# Altium schematic sheet FPGA_7A35T_GTP.SchDoc: RFSoC AMC
size 420 x 297 mm; CompanyName: WUT; DrawnBy: T. Przywozki; Organization: WUT ISE; Address1: Warsaw University of Technology; Address2: Nowowiejska 15/19 00-665 Warsaw; Address3: Tomasz.Przywozki@pw.edu.pl; DocumentNumber: 16; Revision: 1; SheetNumber: 16; SheetTotal: 45; Project: RFSoC AMC; ModifiedBy: T. Przywozki; CreateDate: -; CheckedDate: -; DivGrp: ISE; Designer: T. Przywozki; ModifiedDate: -; ProjectName: ADC/DAC MEZZANINE
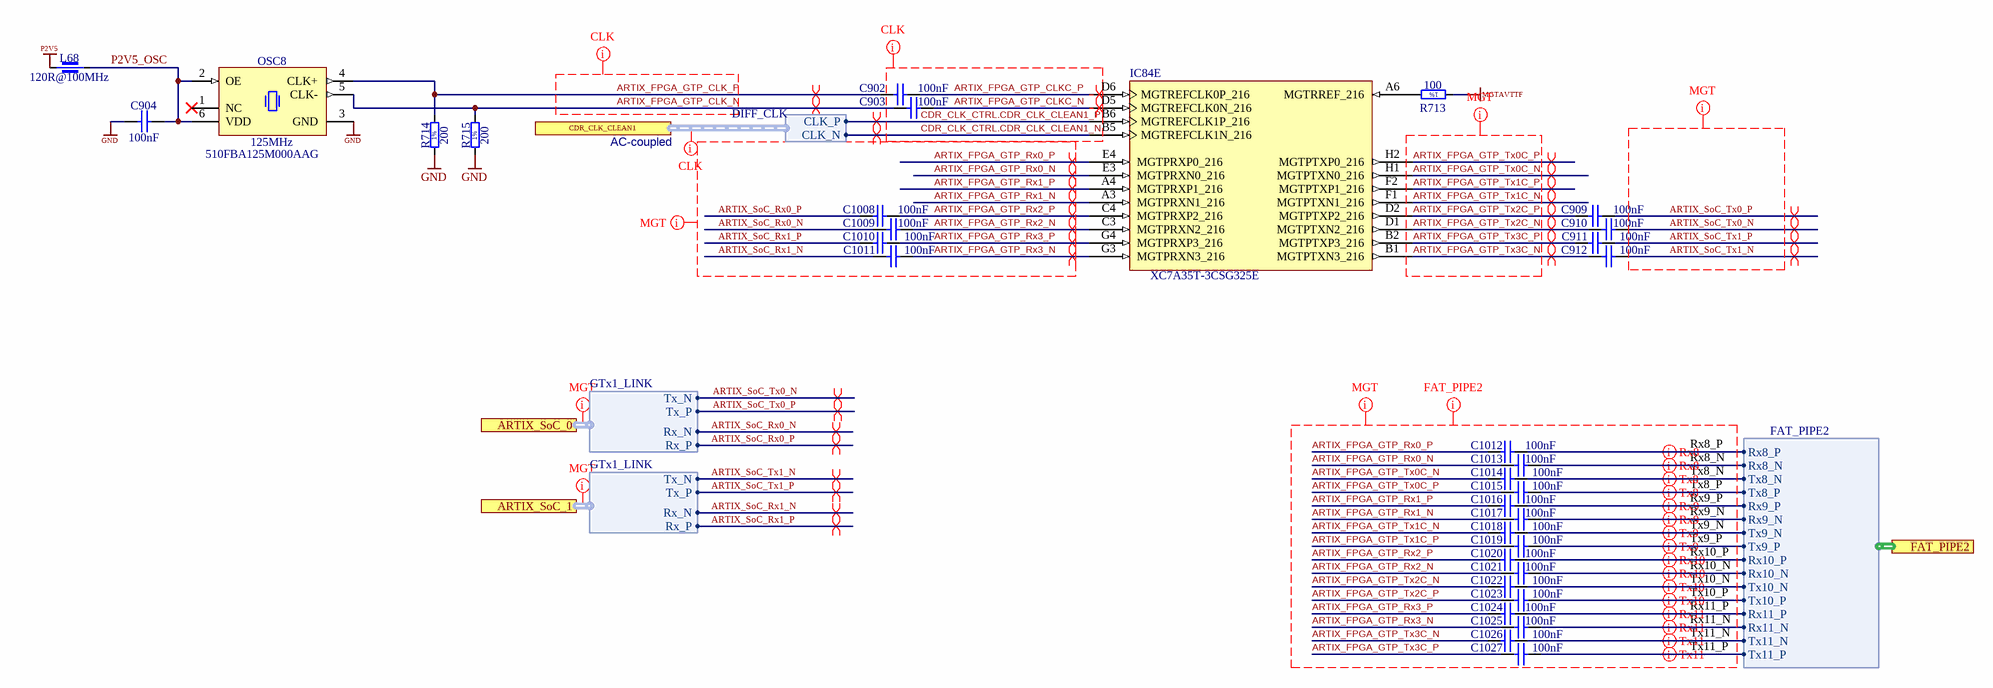
[diagram p0: FPGA_7A35T_GTP.SchDoc]

## Parts
C902  100nF  [CAPC0603X33N]
C903  100nF  [CAPC0603X33N]
C904  100nF  [CAPC0603X33N]
C909  100nF  [CAPC0603X33N]
C910  100nF  [CAPC0603X33N]
C911  100nF  [CAPC0603X33N]
C912  100nF  [CAPC0603X33N]
C1008  100nF  [CAPC0603X33N]
C1009  100nF  [CAPC0603X33N]
C1010  100nF  [CAPC0603X33N]
C1011  100nF  [CAPC0603X33N]
C1012  100nF  [CAPC0603X33N]
C1013  100nF  [CAPC0603X33N]
C1014  100nF  [CAPC0603X33N]
C1015  100nF  [CAPC0603X33N]
C1016  100nF  [CAPC0603X33N]
C1017  100nF  [CAPC0603X33N]
C1018  100nF  [CAPC0603X33N]
C1019  100nF  [CAPC0603X33N]
C1020  100nF  [CAPC0603X33N]
C1021  100nF  [CAPC0603X33N]
C1022  100nF  [CAPC0603X33N]
C1023  100nF  [CAPC0603X33N]
C1024  100nF  [CAPC0603X33N]
C1025  100nF  [CAPC0603X33N]
C1026  100nF  [CAPC0603X33N]
C1027  100nF  [CAPC0603X33N]
IC84  XC7A35T-3CSG325E  [CSG325]  (part E of 9)
L68  120R@100MHz  [INDC1005X55N]
OSC8  125MHz  Manufacturer Part Number: 510FBA125M000AAG  [OSC_SILICON-LAB_SI510-6N(5X7)]
R713  100  [RESC1005X40N]
R714  200  [RESC1005X40N]
R715  200  [RESC1005X40N]

## Ports
ARTIX_SoC_0 (harness GTx1_LINK), ARTIX_SoC_1 (harness GTx1_LINK), CDR_CLK_CLEAN1 (harness DIFF_CLK), FAT_PIPE2 (harness FAT_PIPE2)

## Harnesses
GTx1_LINK: Rx_P, Rx_N, Tx_P, Tx_N
DIFF_CLK: CLK_P, CLK_N
FAT_PIPE2: Rx8_P, Rx8_N, Tx8_N, Tx8_P, Rx9_P, Rx9_N, Tx9_N, Tx9_P, Rx10_P, Rx10_N, Tx10_N, Tx10_P, Rx11_P, Rx11_N, Tx11_N, Tx11_P

## Nets
GND: C904.1 OSC8.3(GND) R714.1 R715.1
MGTAVTTF: R713.1
P2V5: L68.2
ARTIX_FPGA_GTP_CLK_N: C903.1 OSC8.5(CLK-) R715.2
ARTIX_FPGA_GTP_CLK_P: C902.1 OSC8.4(CLK+) R714.2
ARTIX_FPGA_GTP_CLKC_N: C903.2 IC84.D5(MGTREFCLK0N_216)
ARTIX_FPGA_GTP_CLKC_P: C902.2 IC84.D6(MGTREFCLK0P_216)
ARTIX_FPGA_GTP_Rx0_N: C1013.2 IC84.E3(MGTPRXN0_216)
ARTIX_FPGA_GTP_Rx0_P: C1012.2 IC84.E4(MGTPRXP0_216)
ARTIX_FPGA_GTP_Rx1_N: C1017.2 IC84.A3(MGTPRXN1_216)
ARTIX_FPGA_GTP_Rx1_P: C1016.2 IC84.A4(MGTPRXP1_216)
ARTIX_FPGA_GTP_Rx2_N: C1009.1 C1021.2 IC84.C3(MGTPRXN2_216)
ARTIX_FPGA_GTP_Rx2_P: C1008.1 C1020.2 IC84.C4(MGTPRXP2_216)
ARTIX_FPGA_GTP_Rx3_N: C1011.1 C1025.2 IC84.G3(MGTPRXN3_216)
ARTIX_FPGA_GTP_Rx3_P: C1010.1 C1024.2 IC84.G4(MGTPRXP3_216)
ARTIX_FPGA_GTP_Tx0C_N: C1014.2 IC84.H1(MGTPTXN0_216)
ARTIX_FPGA_GTP_Tx0C_P: C1015.2 IC84.H2(MGTPTXP0_216)
ARTIX_FPGA_GTP_Tx1C_N: C1018.2 IC84.F1(MGTPTXN1_216)
ARTIX_FPGA_GTP_Tx1C_P: C1019.2 IC84.F2(MGTPTXP1_216)
ARTIX_FPGA_GTP_Tx2C_N: C910.2 C1022.2 IC84.D1(MGTPTXN2_216)
ARTIX_FPGA_GTP_Tx2C_P: C909.2 C1023.2 IC84.D2(MGTPTXP2_216)
ARTIX_FPGA_GTP_Tx3C_N: C912.2 C1026.2 IC84.B1(MGTPTXN3_216)
ARTIX_FPGA_GTP_Tx3C_P: C911.2 C1027.2 IC84.B2(MGTPTXP3_216)
ARTIX_SoC_Rx0_N: C1009.2 ; port ARTIX_SoC_0.Rx_N
ARTIX_SoC_Rx0_P: C1008.2 ; port ARTIX_SoC_0.Rx_P
ARTIX_SoC_Rx1_N: C1011.2 ; port ARTIX_SoC_1.Rx_N
ARTIX_SoC_Rx1_P: C1010.2 ; port ARTIX_SoC_1.Rx_P
ARTIX_SoC_Tx0_N: C910.1 ; port ARTIX_SoC_0.Tx_N
ARTIX_SoC_Tx0_P: C909.1 ; port ARTIX_SoC_0.Tx_P
ARTIX_SoC_Tx1_N: C912.1 ; port ARTIX_SoC_1.Tx_N
ARTIX_SoC_Tx1_P: C911.1 ; port ARTIX_SoC_1.Tx_P
CDR_CLK_CTRL.CDR_CLK_CLEAN1_N: IC84.B5(MGTREFCLK1N_216) ; port CDR_CLK_CLEAN1.CLK_N
CDR_CLK_CTRL.CDR_CLK_CLEAN1_P: IC84.B6(MGTREFCLK1P_216) ; port CDR_CLK_CLEAN1.CLK_P
P2V5_OSC: C904.2 L68.1 OSC8.2(OE) OSC8.6(VDD)
Rx8_N: C1013.1 ; port FAT_PIPE2.Rx8_N
Rx8_P: C1012.1 ; port FAT_PIPE2.Rx8_P
Rx9_N: C1017.1 ; port FAT_PIPE2.Rx9_N
Rx9_P: C1016.1 ; port FAT_PIPE2.Rx9_P
Rx10_N: C1021.1 ; port FAT_PIPE2.Rx10_N
Rx10_P: C1020.1 ; port FAT_PIPE2.Rx10_P
Rx11_N: C1025.1 ; port FAT_PIPE2.Rx11_N
Rx11_P: C1024.1 ; port FAT_PIPE2.Rx11_P
Tx8_N: C1014.1 ; port FAT_PIPE2.Tx8_N
Tx8_P: C1015.1 ; port FAT_PIPE2.Tx8_P
Tx9_N: C1018.1 ; port FAT_PIPE2.Tx9_N
Tx9_P: C1019.1 ; port FAT_PIPE2.Tx9_P
Tx10_N: C1022.1 ; port FAT_PIPE2.Tx10_N
Tx10_P: C1023.1 ; port FAT_PIPE2.Tx10_P
Tx11_N: C1026.1 ; port FAT_PIPE2.Tx11_N
Tx11_P: C1027.1 ; port FAT_PIPE2.Tx11_P
NetIC84_A6: IC84.A6(MGTRREF_216) R713.2

Not connected (* = marked no-connect by the designer): OSC8 1(NC)*

## Layout directives
net class CLK: (no net found under the mark), ARTIX_FPGA_GTP_CLK_N, ARTIX_FPGA_GTP_CLK_P, ARTIX_FPGA_GTP_CLKC_N, ARTIX_FPGA_GTP_CLKC_P, CDR_CLK_CTRL.CDR_CLK_CLEAN1_N, CDR_CLK_CTRL.CDR_CLK_CLEAN1_P
net class MGT: (no net found under the mark)
net class MGT; net class GT: ARTIX_FPGA_GTP_Rx0_N, ARTIX_FPGA_GTP_Rx0_P, ARTIX_FPGA_GTP_Rx1_N, ARTIX_FPGA_GTP_Rx1_P, ARTIX_FPGA_GTP_Rx2_N, ARTIX_FPGA_GTP_Rx2_P, ARTIX_FPGA_GTP_Rx3_N, ARTIX_FPGA_GTP_Rx3_P, ARTIX_FPGA_GTP_Tx0C_N, ARTIX_FPGA_GTP_Tx0C_P, ARTIX_FPGA_GTP_Tx1C_N, ARTIX_FPGA_GTP_Tx1C_P, ARTIX_FPGA_GTP_Tx2C_N, ARTIX_FPGA_GTP_Tx2C_P, ARTIX_FPGA_GTP_Tx3C_N, ARTIX_FPGA_GTP_Tx3C_P, ARTIX_SoC_Rx0_N, ARTIX_SoC_Rx0_P, ARTIX_SoC_Rx1_N, ARTIX_SoC_Rx1_P, ARTIX_SoC_Tx0_N, ARTIX_SoC_Tx0_P, ARTIX_SoC_Tx1_N, ARTIX_SoC_Tx1_P, Rx8_N, Rx8_P, Rx9_N, Rx9_P, Rx10_N, Rx10_P, Rx11_N, Rx11_P, Tx8_N, Tx8_P, Tx9_N, Tx9_P, Tx10_N, Tx10_P, Tx11_N, Tx11_P
differential pair: ARTIX_FPGA_GTP_CLK_N, ARTIX_FPGA_GTP_CLK_P, ARTIX_FPGA_GTP_CLKC_N, ARTIX_FPGA_GTP_CLKC_P, ARTIX_FPGA_GTP_Rx0_N, ARTIX_FPGA_GTP_Rx0_P, ARTIX_FPGA_GTP_Rx1_N, ARTIX_FPGA_GTP_Rx1_P, ARTIX_FPGA_GTP_Rx2_N, ARTIX_FPGA_GTP_Rx2_P, ARTIX_FPGA_GTP_Rx3_N, ARTIX_FPGA_GTP_Rx3_P, ARTIX_FPGA_GTP_Tx0C_N, ARTIX_FPGA_GTP_Tx0C_P, ARTIX_FPGA_GTP_Tx1C_N, ARTIX_FPGA_GTP_Tx1C_P, ARTIX_FPGA_GTP_Tx2C_N, ARTIX_FPGA_GTP_Tx2C_P, ARTIX_FPGA_GTP_Tx3C_N, ARTIX_FPGA_GTP_Tx3C_P, ARTIX_SoC_Rx0_N, ARTIX_SoC_Rx0_P, ARTIX_SoC_Rx1_N, ARTIX_SoC_Rx1_P, ARTIX_SoC_Tx0_N, ARTIX_SoC_Tx0_P, ARTIX_SoC_Tx1_N, ARTIX_SoC_Tx1_P, CDR_CLK_CTRL.CDR_CLK_CLEAN1_N, CDR_CLK_CTRL.CDR_CLK_CLEAN1_P, Rx8_N, Rx8_P, Rx9_N, Rx9_P, Rx10_N, Rx10_P, Rx11_N, Rx11_P, Tx8_N, Tx8_P, Tx9_N, Tx9_P, Tx10_N, Tx10_P, Tx11_N, Tx11_P
net class FAT_PIPE2: ARTIX_FPGA_GTP_Rx0_N, ARTIX_FPGA_GTP_Rx0_P, ARTIX_FPGA_GTP_Rx1_N, ARTIX_FPGA_GTP_Rx1_P, ARTIX_FPGA_GTP_Rx2_N, ARTIX_FPGA_GTP_Rx2_P, ARTIX_FPGA_GTP_Rx3_N, ARTIX_FPGA_GTP_Rx3_P, ARTIX_FPGA_GTP_Tx0C_N, ARTIX_FPGA_GTP_Tx0C_P, ARTIX_FPGA_GTP_Tx1C_N, ARTIX_FPGA_GTP_Tx1C_P, ARTIX_FPGA_GTP_Tx2C_N, ARTIX_FPGA_GTP_Tx2C_P, ARTIX_FPGA_GTP_Tx3C_N, ARTIX_FPGA_GTP_Tx3C_P, Rx8_N, Rx8_P, Rx9_N, Rx9_P, Rx10_N, Rx10_P, Rx11_N, Rx11_P, Tx8_N, Tx8_P, Tx9_N, Tx9_P, Tx10_N, Tx10_P, Tx11_N, Tx11_P

## Notes on the sheet
- AC-coupled
- Project/Equipment
- Document
- Designer
- Drawn by
- Check.by
- Copyright WUT ISE 2021
  This documentation describes Open Hardware and is licensed under CERN OHL v.1.1. You may redistribute and modify this documentaction under the terms of the CERN OHL v1.1.
  (http://ohwr.org/CERNOHL). This documentation is dristributed WITHOUT ANY EXPRESS OR IMPLIED WARRANTY, INCLUDING OF MERCHANTABLITY, SATISFACTORY QUALITY AND FITNESS FOR A PARTICULAR PURPOSE. Please see the CERN OHL v.1.1 for applicable conditions
- File
- Last Mod.
- Print Date
- Sheet
- Size
- A3
- of
- Rev
- Contact:
- (in symbol R0402_100R_1%_0.0625W_100PPM) 1%
- (in symbol R0402_200R_1%_0.0625W_100PPM) 1%

## Library data of the parts
C902-C904 C909-C912 C1008-C1027 = CC0201_100NF_6.3V_10%_X5R: Non-polarised capacitor; Manufacturer: GENERIC; Manufacturer1 Part Number: 02016D104KAT2A; Part Description: SMD Multilayer Chip Ceramic Capacitor; TC: X5R; Tolerance: ±10%; Voltage: 6.3V; Case: 0201; Manufacturer Part Number: CC0201_100NF_6.3V_10%_X5R; Manufacturer1 Example: AVX; Part Number: CC0201_100NF_6.3V_10%_X5R; Pin Count: 2; SMD: Yes; Status: Not Recommended; Value: 100nF; Component Kind: Standard; Component Type: Standard; Mounted: Yes; Socket: No; Sense: No; Manufacturer1 ComponentHeight: 0.33mm; HelpURL: \\cern.ch\dfs\Applications\Altium\Datasheets\CC0201_X5R_AVX.pdf; Author: CERN DEM JLC; CreateDate: 03.12.2007; LatestRevisionDate: 03.12.2007
IC84 = CMP-0383-00015-1: Artix-7 FPGA, 150 User I/Os, 4 GTP, 324-Ball BGA, Speed Grade 3, Extended Grade, Pb-Free; Manufacturer: Xilinx; CMTs: 5; Available User I/O: 150; GTP: 4; Speed Grades: 3; Total Block RAM: 1800 Kb; Logic Cells: 33280; ComponentLink3URL: http://www.xilinx.com/support/documentation/user_guides/ug475_7Series_Pkg_Pinout.pdf; ComponentLink3Description: Pinout; Operating Temperature Range: Extended; PackageReference: CSG-325; PackageDescription: 324-Ball Wire-Bond Chip-Scale BGA, Body 15 x 15 mm, Pitch 0.8 mm; ComponentLink4URL: http://www.xilinx.com/support/documentation/user_guides/ug475_7Series_Pkg_Pinout.pdf; ComponentLink1Description: Manufacturer URL; ComponentLink2Description: Datasheet; DatasheetVersion: Rev. 1.15; PartNumber: XC7A35T-3CSG325E; Mounting Technology: Surface Mount; ComponentLink1URL: http://www.xilinx.com/; PackageVersion: Rev. 1.11; ComponentLink2URL: http://www.xilinx.com/support/documentation/data_sheets/ds180_7Series_Overview.pdf; Maximum Distributed RAM: 400 Kb; ComponentLink4Description: Package Specification
L68 = IND0402_MURATA_BLM15PX121SN1D: Manufacturer: MURATA; Part Description: SMD EMIFIL Chip Ferrite Bead; Power: 2A; Resistance: 0.055R; Tolerance: ±25%; Case: 0402; ComponentHeight: 0.55mm; Manufacturer Part Number: BLM15PX121SN1D; Part Number: IND0402_MURATA_BLM15PX121SN1D; Pin Count: 2; SMD: Yes; Value: 120R@100MHz; Component Kind: Standard; Component Type: Standard; Status: None; Mounted: Yes; Socket: No; Sense: No; HelpURL: \\cern.ch\dfs\Applications\Altium\Datasheets\IND0402_MURATA_BLM15PX.pdf; Author: CERN DEM JMW; CreateDate: 19.02.2014; LatestRevisionDate: 25.10.2018
OSC8 = OSC_125MHZ_SILICON-LAB_510FBA125M000AAG: Crystal Oscillator 6 pins, Si510 (LVDS/LVPECL/HCSL/Dual CMOS); Part Description: 2.5V ±25ppm LVDS Crystal Oscillator (XO), Si510 Series; Manufacturer: SILICON LABS; PressFit: No; Bonding: No; Part Number: OSC_125MHZ_SILICON-LAB_510FBA125M000AAG; Component Kind: Standard; Component Type: Standard; PackageDescription: Oscillator Si510 Series, 6 pins, 5x7mm; Value: 125MHz; Pin Count: 6; Mounted: Yes; Socket: No; SMD: Yes; Sense: No; ComponentHeight: 1.8mm; HelpURL: \\cern.ch\dfs\Applications\Altium\Datasheets\OSC_SILICON-LAB_SI510.pdf; Author: CERN DEM JMW; CreateDate: 10.08.2015; LatestRevisionDate: 26.11.2018
R713 = R0402_100R_1%_0.0625W_100PPM: Resistor - 1%; Manufacturer: GENERIC; Manufacturer1 Part Number: 232270671001L; Part Description: General Purpose Thick Film Chip Resistor; TC: ±100ppm/°C; PressFit: No; Case: 0402; Manufacturer Part Number: R0402_100R_1%_0.0625W_100PPM; Manufacturer1 ComponentHeight: 0.4mm; Manufacturer1 Example: YAGEO PHYCOMP; Part Number: R0402_100R_1%_0.0625W_100PPM; Pin Count: 2; Power: 0.0625W; Sense: No; SMD: Yes; Status: Not Recommended; Tolerance: ±1%; Value: 100; Component Kind: Standard; Component Type: Standard; Mounted: Yes; Socket: No; HelpURL: \\cern.ch\dfs\Applications\Altium\Datasheets\R0402_Phycomp_RC0402.pdf; Author: CERN DEM JLC; CreateDate: 03.12.2007; LatestRevisionDate: 17.10.2012
R714 R715 = R0402_200R_1%_0.0625W_100PPM: Resistor - 1%; Manufacturer: GENERIC; Manufacturer1 Part Number: 232270672001L; Part Description: General Purpose Thick Film Chip Resistor; TC: ±100ppm/°C; PressFit: No; Case: 0402; Manufacturer Part Number: R0402_200R_1%_0.0625W_100PPM; Manufacturer1 ComponentHeight: 0.4mm; Manufacturer1 Example: YAGEO PHYCOMP; Part Number: R0402_200R_1%_0.0625W_100PPM; Pin Count: 2; Power: 0.0625W; Sense: No; SMD: Yes; Status: Not Recommended; Tolerance: ±1%; Value: 200; Component Kind: Standard; Component Type: Standard; Mounted: Yes; Socket: No; HelpURL: \\cern.ch\dfs\Applications\Altium\Datasheets\R0402_Phycomp_RC0402.pdf; Author: CERN DEM JLC; CreateDate: 03.12.2007; LatestRevisionDate: 17.10.2012